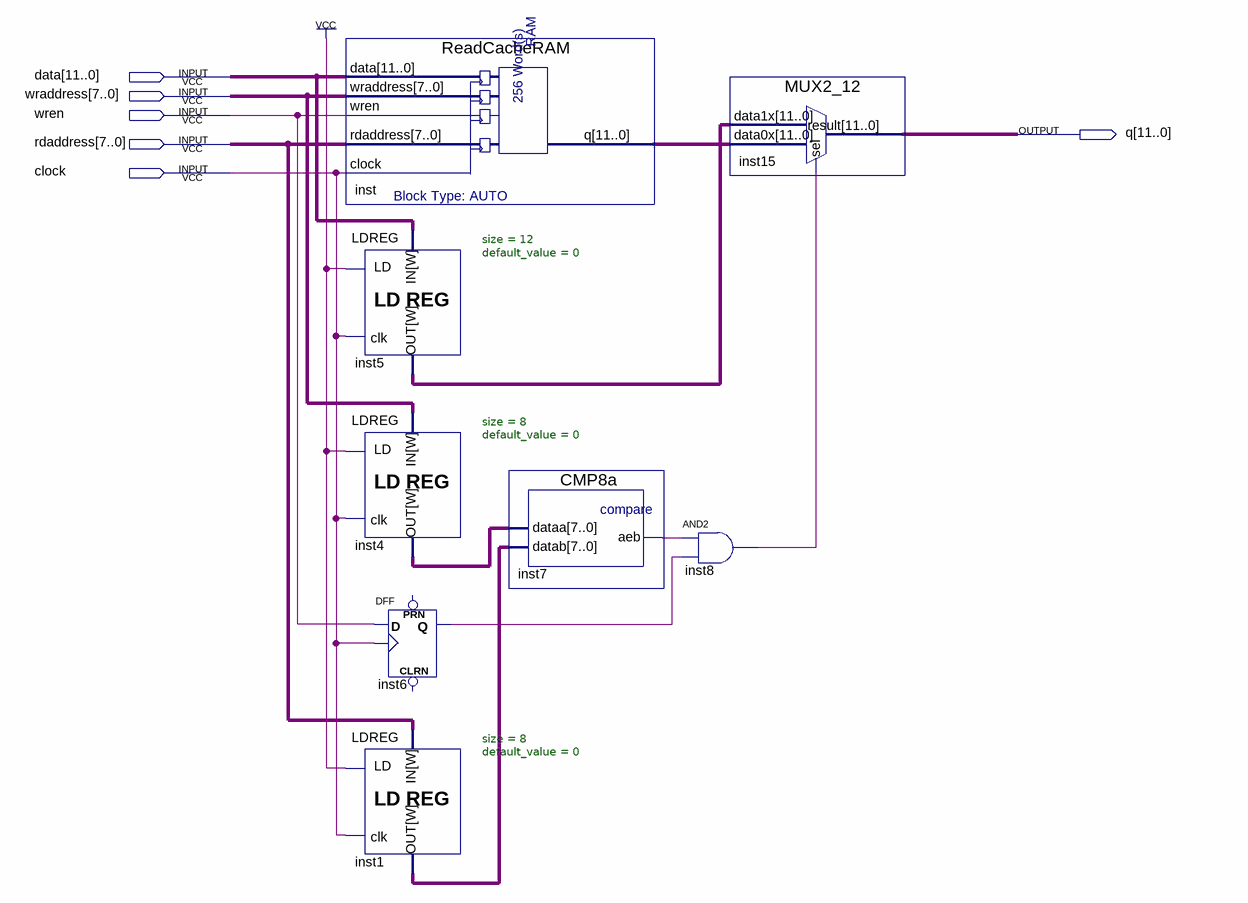
[diagram p0: schematic sheet]
// Quartus schematic ActualReadCacheRAM.bdf as structural Verilog: 8 symbols, 6 pins
module ActualReadCacheRAM (
  input  [11:0] data,
  input  [7:0] wraddress,
  input  wren,
  input  [7:0] rdaddress,
  input  clock,
  output [11:0] q
);

  wire inst6_q, inst7_aeb, inst8_out;
  wire [7:0] inst1_data_out, inst4_data_out;
  wire [11:0] inst5_data_out, inst_q;

  ReadCacheRAM inst (.data(data), .wraddress(wraddress), .wren(wren), .rdaddress(rdaddress), .clock(clock), .q(inst_q));
  LDREG #(.size(12), .default_value(0)) inst5 (.clk(clock), .data_in(data), .ld(1'b1), .data_out(inst5_data_out));
  LDREG #(.size(8), .default_value(0)) inst4 (.clk(clock), .data_in(wraddress), .ld(1'b1), .data_out(inst4_data_out));
  LDREG #(.size(8), .default_value(0)) inst1 (.clk(clock), .data_in(rdaddress), .ld(1'b1), .data_out(inst1_data_out));
  DFF inst6 (.CLK(clock), .D(wren), .Q(inst6_q));  // open: CLRN, PRN
  CMP8a inst7 (.dataa(inst4_data_out), .datab(inst1_data_out), .aeb(inst7_aeb));
  MUX2_12 inst15 (.data1x(inst5_data_out), .data0x(inst_q), .sel(inst8_out), .result(q));
  and inst8 (inst8_out, inst7_aeb, inst6_q);
endmodule
